# Altium project FireWireSw.PrjPcb
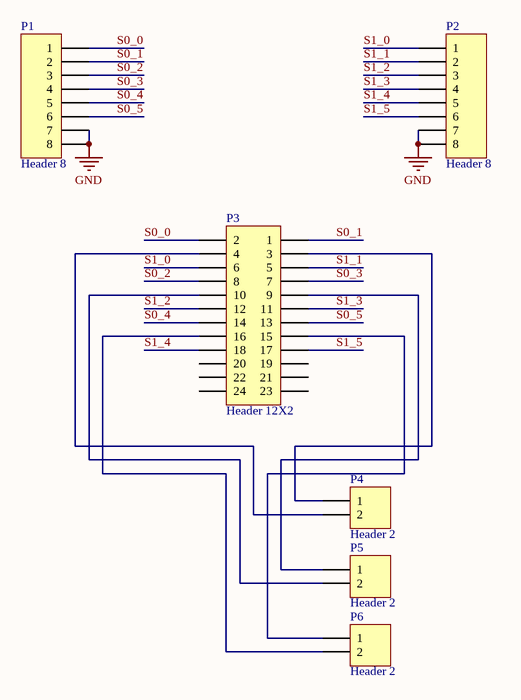
[diagram p0: sch.SchDoc]
1 sheet, 6 parts. Net scope: global (net labels, ports and power ports of the same name join across sheets).
Board file: brd.PcbDoc

## Sheet sch.SchDoc
size A4

### Parts
P1  Header 8  [DS1102]
P2  Header 8  [DS1102]
P3  Header 12X2  [P2K-8]
P4  Header 2  [HDR1X2]
P5  Header 2  [HDR1X2]
P6  Header 2  [HDR1X2]

### Nets
GND: P1.7 P1.8 P2.7 P2.8
S0_0: P1.1 P3.2
S0_1: P1.2 P3.1
S0_2: P1.3 P3.8
S0_3: P1.4 P3.7
S0_4: P1.5 P3.14
S0_5: P1.6 P3.13
S1_0: P2.1 P3.6
S1_1: P2.2 P3.5
S1_2: P2.3 P3.12
S1_3: P2.4 P3.11
S1_4: P2.5 P3.18
S1_5: P2.6 P3.17
NetP3_3: P3.3 P4.1
NetP3_4: P3.4 P4.2
NetP3_9: P3.9 P5.1
NetP3_10: P3.10 P5.2
NetP3_15: P3.15 P6.1
NetP3_16: P3.16 P6.2

Not connected (* = marked no-connect by the designer): P3 19 20 21 22 23 24

### Library data of the parts
P1 P2 = Header 8: Header, 8-Pin; LatestRevisionDate: 17-Jul-2002; LatestRevisionNote: Re-released for DXP Platform.; Publisher: Altium Limited
P3 = Header 12X2: Header, 12-Pin, Dual row; LatestRevisionDate: 17-Jul-2002; LatestRevisionNote: Re-released for DXP Platform.; Publisher: Altium Limited
P4-P6 = Header 2: Header, 2-Pin; LatestRevisionDate: 17-Jul-2002; LatestRevisionNote: Re-released for DXP Platform.; Publisher: Altium Limited